# EAGLE schematic Esquema v2 (EAGLE 9.7.0)
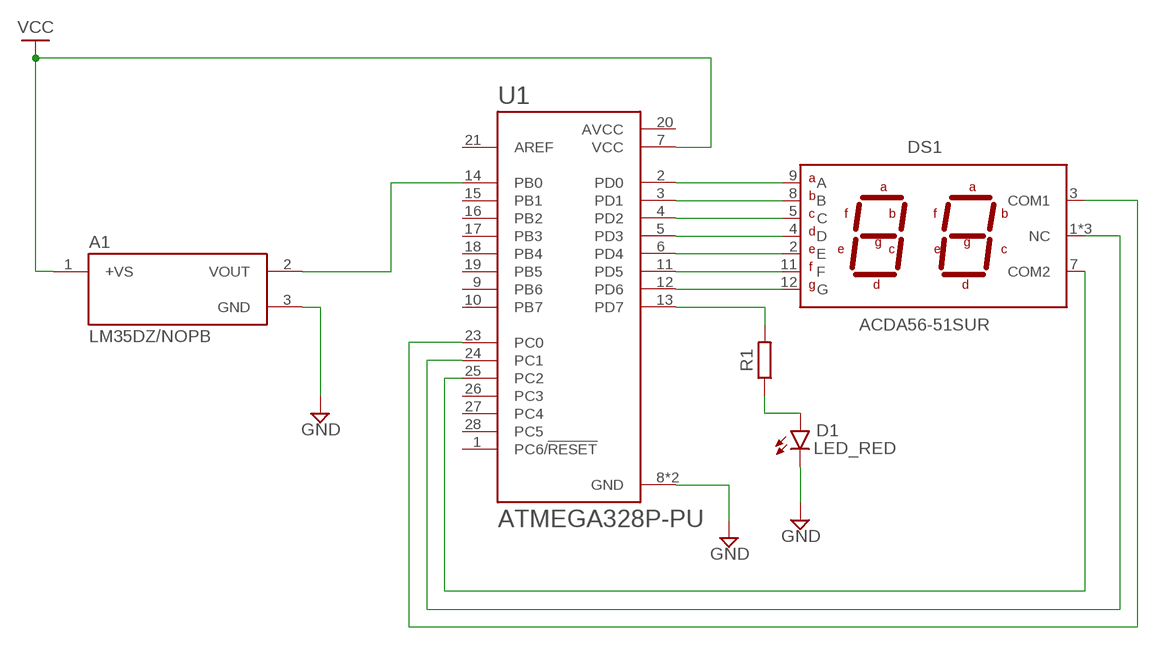
[diagram p0: schematic, sheet 1]

## Parts
A1  LM35DZ/NOPB  [TO92127P521H735-3]
D1  LED_RED  LED_RADIAL_RED  [LEDRD254W60D565H860B]
DS1  ACDA56-51SUR  [ACDA56-51SURKWA]
R1  R_AXIAL-7.2MM-PITCH  [RESAD724W46L381D178B]
U1  ATMEGA328P-PU  [DIP794W46P254L2967H457Q28B]

## Nets
GND: A1.3(GND) D1.2(C) U1.8(GND) U1.22(GND)
N$1: A1.2(VOUT) U1.14(PB0)
N$2: D1.1(A) R1.1
N$3: DS1.9(A) U1.2(PD0)
N$4: DS1.8(B) U1.3(PD1)
N$5: DS1.5(C) U1.4(PD2)
N$6: DS1.4(D) U1.5(PD3)
N$7: DS1.2(E) U1.6(PD4)
N$8: DS1.11(F) U1.11(PD5)
N$9: DS1.12(G) U1.12(PD6)
N$10: R1.2 U1.13(PD7)
N$11: DS1.3(COM1) U1.23(PC0)
N$12: DS1.1(NC) DS1.6(NC) DS1.10(NC) U1.24(PC1)
N$13: DS1.7(COM2) U1.25(PC2)
VCC: A1.1(+VS) U1.7(VCC)
Unconnected: U1.1(PC6/!RESET) U1.9(PB6) U1.10(PB7) U1.15(PB1) U1.16(PB2) U1.17(PB3) U1.18(PB4) U1.19(PB5) U1.21(AREF) U1.26(PC3) U1.27(PC4) U1.28(PC5)

## Power pins joined to a net without a drawn wire
AVCC: U1.20(AVCC)

## Library data of the parts
A1 = LM35DZ_NOPB:LM35DZ/NOPB; MANUFACTURER: Texas Instruments; MAXIMUM_PACKAGE_HEIGHT: 7.35mm; PARTREV: H; SNAPEDA_PACKAGE_ID: 102642; STANDARD: IPC-7351B
D1 = Opto-Electronic:LED_RADIAL: LED - Generic; CATEGORY: Opto-Electronic; SUB-CATEGORY: LED
DS1 = Display_LED:ACDA56-51SUR: Dual Digit Numeric Display - 7SEG, 0.56" Character size, RED, 10SMD Datasheet <https://www.kingbrightusa.com/images/catalog/SPEC/ACDA56-51SURKWA.pdf>; CATEGORY: DISPLAY; COLOR: Hyper Red (AlGaInP); CONFIGURATION: Common Anode; DESCRIPTION: The Hyper Red source color devices are made with AlGaInP on GaAs substrate Light Emitting Diode; DIGIT: Dual Digit; MANUFACTURER: Kingbright; MPN: ACDA56-51SURKWA; OPERATING_TEMP: -40°C to +85 °C; PART_STATUS: Active; ROHS_COMPLIANT: COMPLIANT; SERIES: -; SUB-CATEGORY: LED; THERMALLOSS: 0.075 W; TYPE: 7-Segment
R1 = Resistor:R: Resistor Fixed - Generic; CATEGORY: Resistor; SUB-CATEGORY: Fixed
U1 = ATMEGA328P-PU:ATMEGA328P-PU: ATmega Series 20 MHz 32 KB Flash 2 KB SRAM 8-Bit Microcontroller - DIP-28; MANUFACTURER: Atmel